# Altium schematic sheet MicroController.SchDoc
size A4; SheetNumber: 2; SheetTotal: 7
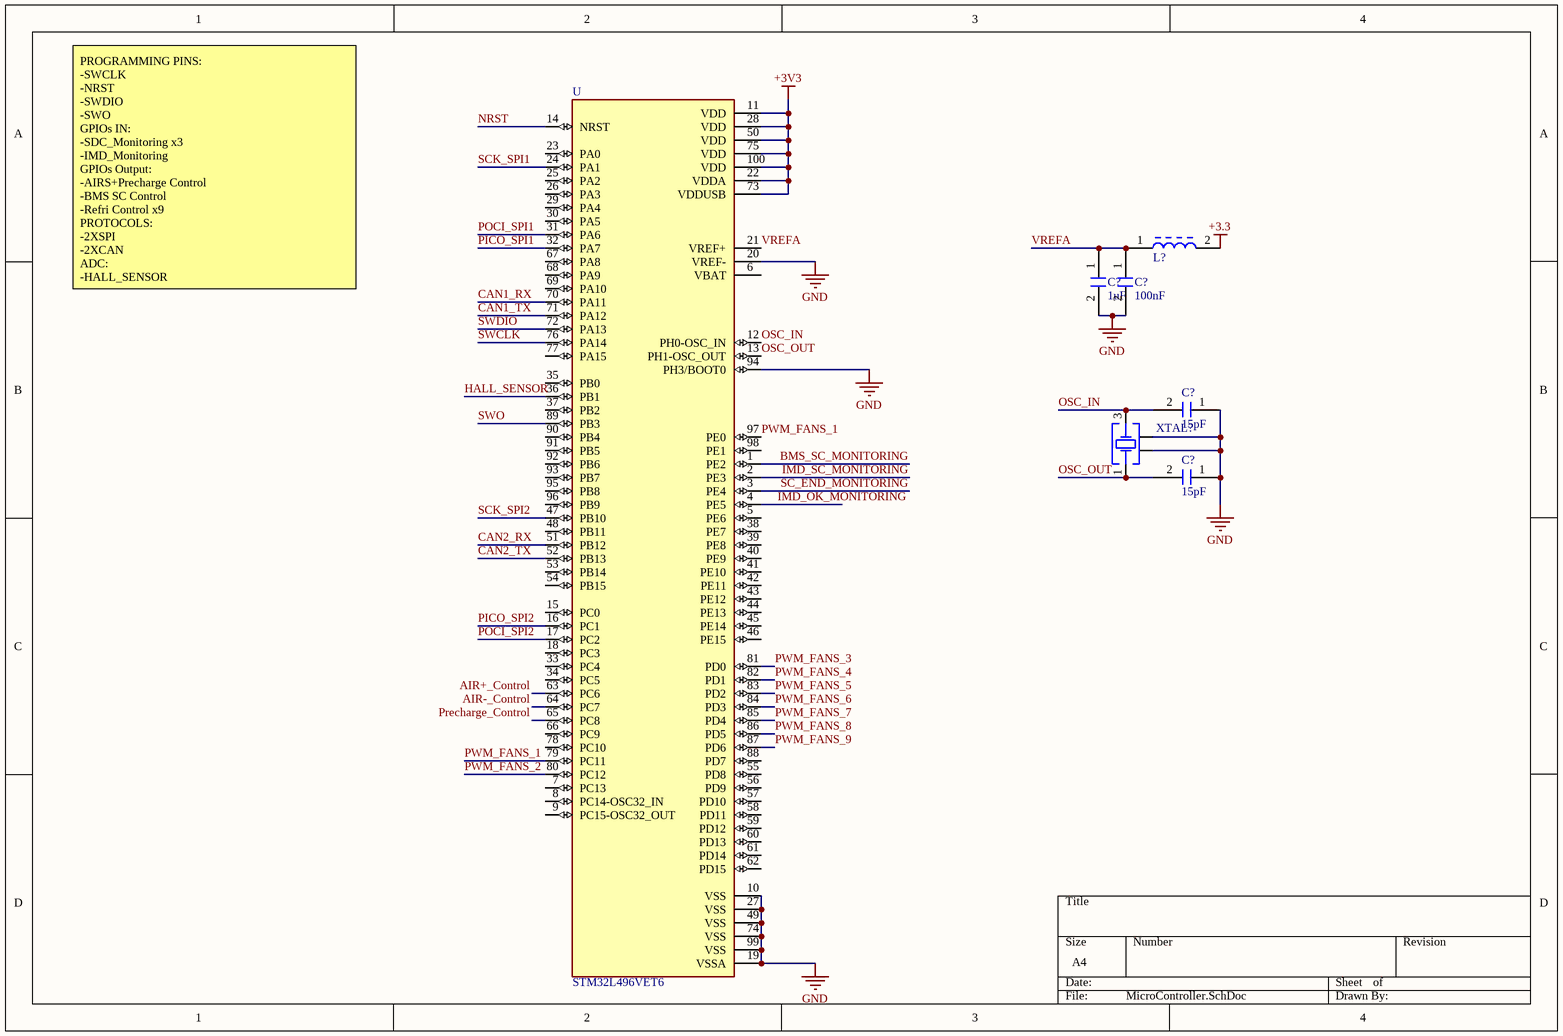
[diagram p0: MicroController.SchDoc]

## Parts
(Parts that share a designator on the sheet are numbered #1, #2 ... from top to bottom, then left to right.)
C?#1  Capacitance: 1uF  [C0805FNPC-R]  (hidden comment: 885012207103)
C?#2  Capacitance: 100nF  [C0805FNPC-R]  (hidden comment: 885012207098)
C?#3  Capacitance: 15pF  [C0805FNPC-R]  (hidden comment: 885012007052)
C?#4  Capacitance: 15pF  [C0805FNPC-R]  (hidden comment: 885012007052)
L?  782853561  [L_Ferrite_bead_0805]  (value not drawn)
U  STM32L496VET6  [QFP100P50_1600X1600X160L60X22N]
XTAL?  20MHz  [XTAL_CFPX-104_5_3.2]  (value not drawn)

## Nets
+3.3: L?.2
+3V3: U.11(VDD) U.22(VDDA) U.28(VDD) U.50(VDD) U.73(VDDUSB) U.75(VDD) U.100(VDD)
GND: C?#1.2 C?#2.2 C?#3.1 C?#4.1 U.10(VSS) U.19(VSSA) U.20(VREF-) U.27(VSS) U.49(VSS) U.74(VSS) U.94(PH3/BOOT0) U.99(VSS) XTAL?.2(GND_&_Lid) XTAL?.4(GND_&_Lid)
AIR+_Control: U.63(PC6)
AIR-_Control: U.64(PC7)
BMS_SC_MONITORING: U.1(PE2)
CAN1_RX: U.70(PA11)
CAN1_TX: U.71(PA12)
CAN2_RX: U.51(PB12)
CAN2_TX: U.52(PB13)
HALL_SENSOR: U.36(PB1)
IMD_OK_MONITORING: U.4(PE5)
IMD_SC_MONITORING: U.2(PE3)
NRST: U.14(NRST)
OSC_IN: C?#3.2 U.12(PH0-OSC_IN) XTAL?.3(Crystal)
OSC_OUT: C?#4.2 U.13(PH1-OSC_OUT) XTAL?.1(Crystal)
PICO_SPI1: U.32(PA7)
PICO_SPI2: U.16(PC1)
POCI_SPI1: U.31(PA6)
POCI_SPI2: U.17(PC2)
Precharge_Control: U.65(PC8)
PWM_FANS_1: U.79(PC11) U.97(PE0)
PWM_FANS_2: U.80(PC12)
PWM_FANS_3: U.81(PD0)
PWM_FANS_4: U.82(PD1)
PWM_FANS_5: U.83(PD2)
PWM_FANS_6: U.84(PD3)
PWM_FANS_7: U.85(PD4)
PWM_FANS_8: U.86(PD5)
PWM_FANS_9: U.87(PD6)
SC_END_MONITORING: U.3(PE4)
SCK_SPI1: U.24(PA1)
SCK_SPI2: U.47(PB10)
SWCLK: U.76(PA14)
SWDIO: U.72(PA13)
SWO: U.89(PB3)
VREFA: C?#1.1 C?#2.1 L?.1 U.21(VREF+)

Not connected (* = marked no-connect by the designer): U 5(PE6) 6(VBAT) 7(PC13) 8(PC14-OSC32_IN) 9(PC15-OSC32_OUT) 15(PC0) 18(PC3) 23(PA0) 25(PA2) 26(PA3) 29(PA4) 30(PA5) 33(PC4) 34(PC5) 35(PB0) 37(PB2) 38(PE7) 39(PE8) 40(PE9) 41(PE10) 42(PE11) 43(PE12) 44(PE13) 45(PE14) 46(PE15) 48(PB11) 53(PB14) 54(PB15) 55(PD8) 56(PD9) 57(PD10) 58(PD11) 59(PD12) 60(PD13) 61(PD14) 62(PD15) 66(PC9) 67(PA8) 68(PA9) 69(PA10) 77(PA15) 78(PC10) 88(PD7) 90(PB4) 91(PB5) 92(PB6) 93(PB7) 95(PB8) 96(PB9) 98(PE1)

## Notes on the sheet
- PROGRAMMING PINS:
  -SWCLK
  -NRST
  -SWDIO
  -SWO
  GPIOs IN:
  -SDC_Monitoring x3
  -IMD_Monitoring
  GPIOs Output:
  -AIRS+Precharge Control
  -BMS SC Control
  -Refri Control x9
  PROTOCOLS:
  -2XSPI
  -2XCAN
  ADC:
  -HALL_SENSOR

## Library data of the parts
C?#1 = C1u-50V-0805FNPC-X7R: Multilayer Ceramic Capacitor, Wcap-Csgp Series, 1 F, 10%, X7R, 50 V, 0805 [2012 Metric] Rohs Compliant: Yes; Manufacturer 1: Wurth Electronics; Voltage Rating: 50V; .Creator: GP; Supplier 1: RSComponents; Manufacturer Part Number 1: 885012207103; RoHS: Yes; Category: Ceramic Capacitors; Stock 1: 5100; Pricing 1: 50=0,27200, 250=0,25300, 500=0,22800, 1250=0,20100, 2500=0,17100 (GBP); Mount: Surface Mount; Case/Package: 0805; Case Code (Metric): 2012; Case Code (Imperial): 0805; Min Operating Temperature: -55°C; Max Operating Temperature: 85°C; Packaging: Cut Tape; Dielectric: X7R; Tolerance: 10%; Voltage Rating (DC): 50V; Length: 0.079inch; Width: 0.049inch; Thickness: 0.053inch; REACH SVHC: Unknown; RoHS Compliant: Yes; ComponentLink1URL: http://www.farnell.com/datasheets/1958501.pdf?src-supplier=Farnell; ComponentLink1Description: http://www.farnell.com/datasheets/1958501.pdf?src-supplier=Farnell; ComponentLink2URL: http://www.farnell.com/datasheets/1958501.pdf?src-supplier=Element14; ComponentLink2Description: http://www.farnell.com/datasheets/1958501.pdf?src-supplier=Element14; ComponentLink3URL: https://katalog.we-online.de/pbs/datasheet/885012107003.pdf?src-supplier=Digi-Key; ComponentLink3Description: https://katalog.we-online.de/pbs/datasheet/885012107003.pdf?src-supplier=Digi-Key; ComponentLink4URL: http://www.farnell.com/datasheets/1958501.pdf?src-supplier=Newark; ComponentLink4Description: http://www.farnell.com/datasheets/1958501.pdf?src-supplier=Newark; Supplier Part Number 1: 1813523
C?#2 = C100n-50V-0805FNPC-X7R: Cap, 0.1ΜF, 50V, 10%, X7R, 0805; Manufacturer 1: Wurth Electronics; .Creator: DR; Supplier 1: RSComponents; Manufacturer Part Number 1: 885012207098; RoHS: Yes; Category: Ceramic Capacitors; Stock 1: 8000; Pricing 1: 100=0,10200, 500=0,07100, 2000=0,06100 (GBP); Mount: Surface Mount; Case/Package: 0805; Case Code (Metric): 2012; Case Code (Imperial): 0805; Min Operating Temperature: -55°C; Max Operating Temperature: 125°C; Packaging: Cut Tape; Voltage Rating: 50V; Dielectric: X7R; Tolerance: 10%; Voltage Rating (DC): 50V; Length: 0.079inch; Width: 0.049inch; Thickness: 0.035inch; REACH SVHC: Unknown; RoHS Compliant: Yes; ComponentLink1URL: http://www.farnell.com/datasheets/1958498.pdf?src-supplier=Farnell; ComponentLink1Description: http://www.farnell.com/datasheets/1958498.pdf?src-supplier=Farnell; ComponentLink2URL: http://www.farnell.com/datasheets/1958498.pdf?src-supplier=Element14; ComponentLink2Description: http://www.farnell.com/datasheets/1958498.pdf?src-supplier=Element14; ComponentLink3URL: https://katalog.we-online.de/pbs/datasheet/885012207098.pdf?src-supplier=Digi-Key; ComponentLink3Description: https://katalog.we-online.de/pbs/datasheet/885012207098.pdf?src-supplier=Digi-Key; ComponentLink4URL: http://www.farnell.com/datasheets/1958498.pdf?src-supplier=Newark; ComponentLink4Description: http://www.farnell.com/datasheets/1958498.pdf?src-supplier=Newark; Supplier Part Number 1: 1813493
C?#3 C?#4 = C15p-50V-0805FNPC-NP0: Cap, 15PF, 50V, 5%, C0G/NP0, 0805; Manufacturer 1: Wurth Electronics; .Creator: DR; Supplier 1: Newark; Manufacturer Part Number 1: 885012007052; RoHS: Yes; Category: Ceramic Capacitors; Stock 1: 815; Pricing 1: 1=0,10800, 10=0,05200, 25=0,05100, 50=0,04900, 100=0,04800, 250=0,04600, 500=0,04300 (USD); Mount: Surface Mount; Case/Package: 0805; Case Code (Metric): 2012; Case Code (Imperial): 0805; Min Operating Temperature: -55°C; Max Operating Temperature: 125°C; Packaging: Cut Tape; Voltage Rating: 50V; Tolerance: 5%; Length: 0.079inch; Width: 0.049inch; Thickness: 0.028inch; RoHS Compliant: Yes; ComponentLink1URL: http://www.farnell.com/datasheets/2031702.pdf?src-supplier=Farnell; ComponentLink1Description: http://www.farnell.com/datasheets/2031702.pdf?src-supplier=Farnell; ComponentLink2URL: http://katalog.we-online.de/pbs/datasheet/885012007052.pdf?src-supplier=Digi-Key; ComponentLink2Description: http://katalog.we-online.de/pbs/datasheet/885012007052.pdf?src-supplier=Digi-Key; ComponentLink3URL: https://katalog.we-online.de/pbs/datasheet/885012007052.pdf?src-supplier=Digi-Key; ComponentLink3Description: https://katalog.we-online.de/pbs/datasheet/885012007052.pdf?src-supplier=Digi-Key; Supplier Part Number 1: 15AC9316
L? = L_Ferrite_bead_782853561: Manufacturer: Murata; Manufacturer Part Number: BLM18EG331TN1D; Material: Ferrite,Steel; Impedance: 330R; DC Resistance (DCR): 210mR; Tolerance: 25%; Current Rating: 500mA; Number of Lines: 1; Test Frequency: 100MHz; .Creator: GP; Supplier 1: Digi-Key; RoHS: Yes; Category: Ferrite Beads and Chips; Stock 1: 20037; Pricing 1: 1=0,23000, 10=0,17500, 25=0,14520, 50=0,12520, 100=0,11260, 250=0,09508, 500=0,08508, 1000=0,07257 (USD); Case/Package: 0603; Number of Pins: 2; Core Material: Ferrite; Case Code (Metric): 1608; Case Code (Imperial): 0603; Min Operating Temperature: -55°C; Max Operating Temperature: 125°C; Packaging: Tape and Reel; Max DC Current: 500mA; Number of Circuits: 1; Package Quantity: 1; Max Current Rating: 500mA; Termination: SMD/SMT; Series: BLM18E; Resistance: 210mR; Length: 1.6mm; Width: 0.8mm; Height: 0.8mm; Depth: 0.8mm; REACH SVHC: No SVHC; Lead Free: Lead Free; RoHS Compliant: Yes; ComponentLink1URL: https://datasheet.ciiva.com/1467/5169-1467232.pdf?src-supplier=Element14; ComponentLink1Description: https://datasheet.ciiva.com/1467/5169-1467232.pdf?src-supplier=Element14; ComponentLink2URL: https://datasheet.ciiva.com/11795/0900766b811b5866-11795405.pdf?src-supplier=RSComponents; ComponentLink2Description: https://datasheet.ciiva.com/11795/0900766b811b5866-11795405.pdf?src-supplier=RSComponents; ComponentLink3URL: https://datasheet.ciiva.com/41449/001172267-da-01-en-drossel-0603-330r-1-6x0-8mm-4000st-41449581.pdf?src-supplier=Conrad; ComponentLink3Description: https://datasheet.ciiva.com/41449/001172267-da-01-en-drossel-0603-330r-1-6x0-8mm-4000st-41449581.pdf?src-supplier=Conrad; ComponentLink4URL: https://datasheet.ciiva.com/1467/5169-1467233.pdf?src-supplier=Element14; ComponentLink4Description: https://datasheet.ciiva.com/1467/5169-1467233.pdf?src-supplier=Element14; ComponentLink5URL: https://datasheet.ciiva.com/1561/5169-1561345.pdf?src-supplier=Newark; ComponentLink5Description: https://datasheet.ciiva.com/1561/5169-1561345.pdf?src-supplier=Newark; ComponentLink6URL: https://datasheet.ciiva.com/3082/l0110s0101blm18e-3082714.pdf?src-supplier=Avnet; ComponentLink6Description: https://datasheet.ciiva.com/3082/l0110s0101blm18e-3082714.pdf?src-supplier=Avnet; ComponentLink7URL: https://datasheet.ciiva.com/6211/l0110s0101blm18e-6211470.pdf?src-supplier=Digi-Key; ComponentLink7Description: https://datasheet.ciiva.com/6211/l0110s0101blm18e-6211470.pdf?src-supplier=Digi-Key; ComponentLink8URL: https://datasheet.ciiva.com/6211/l0110s0101blm18e-6211471.pdf?src-supplier=Digi-Key; ComponentLink8Description: https://datasheet.ciiva.com/6211/l0110s0101blm18e-6211471.pdf?src-supplier=Digi-Key; Supplier Part Number 1: 490-5913-1-ND
U = CMP-00197-2: ARMÂ® CortexÂ®-M4 STM32L4 Microcontroller IC 32-Bit 80MHz 512KB _1M x 8_ FLASH 100-LQFP _14x14_; MF: STMicroelectronics; SnapEDA_Link: https://www.snapeda.com/parts/STM32L496VGT6/STMicroelectronics/view-part/696196/?ref=snap; Case/Package: LQFP-100 STMicroelectronics; Source: SnapEDAsch.SchLib; Pins: 100; MP: STM32L496VET6; Design Item ID: STM32L496VET6; Component Type: Standard; Value: *; Price: None; Availability: Unavailable
XTAL? = XTAL_CPFX104_5_3.2: WE-XTAL Quartz Crystal, SMT, CFPX-104, 20MHz, +/-20ppm; Manufacturer Part Number: 830056808; Manufacturer: Wurth Elektronik; Frequency Stability: +/-30ppm; Load Capacitance: 18pF; ComponentLink1Description: Website Link; ComponentLink1URL: https://www.we-online.com/redexpert/article/830056808?ad; ComponentLink2Description: Datasheet Link; ComponentLink2URL: https://www.we-online.com/redexpert/spec/830056808?ad; Category: Crystals; Match Code: WE-XTAL; Mount: Surface Mount; Operating Temperature Max: 85°C; Operating Temperature Min: -40°C; Packaging: Tape and Reel; Case/Size Code: CFPX-104; Length: 5mm; Width: 3.2mm; Height: 1mm; Frequency: 20MHz; Frequency Tolerance: +/-20ppm